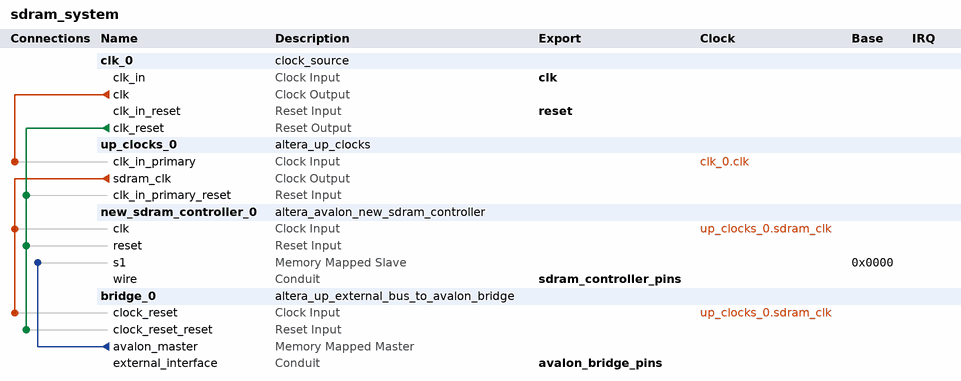
[diagram p0: system contents]
# Platform Designer (Qsys) system sdram_system, Cyclone II EP2C20F484C7
# Parameters at their usual value, and those the tool derives, are not listed.
package require -exact qsys 13.0
create_system sdram_system
set_project_property DEVICE_FAMILY {Cyclone II}
set_project_property DEVICE EP2C20F484C7

add_instance clk_0 clock_source 13.0
set_instance_parameter_value clk_0 clockFrequency 50000000

add_instance up_clocks_0 altera_up_clocks 13.0
set_instance_parameter_value up_clocks_0 board DE1
set_instance_parameter_value up_clocks_0 vga_clk false
set_instance_parameter_value up_clocks_0 audio_clk false
set_instance_parameter_value up_clocks_0 audio_clk_freq 12.288

add_instance new_sdram_controller_0 altera_avalon_new_sdram_controller 13.0.1.99.2
set_instance_parameter_value new_sdram_controller_0 TAC 5.5
set_instance_parameter_value new_sdram_controller_0 TRCD 20.0
set_instance_parameter_value new_sdram_controller_0 TRP 20.0
set_instance_parameter_value new_sdram_controller_0 casLatency 3
set_instance_parameter_value new_sdram_controller_0 columnWidth 8
set_instance_parameter_value new_sdram_controller_0 dataWidth 16
set_instance_parameter_value new_sdram_controller_0 generateSimulationModel true
set_instance_parameter_value new_sdram_controller_0 model single_Micron_MT48LC4M32B2_7_chip
set_instance_parameter_value new_sdram_controller_0 numberOfBanks 4
set_instance_parameter_value new_sdram_controller_0 numberOfChipSelects 1
set_instance_parameter_value new_sdram_controller_0 powerUpDelay 100.0
set_instance_parameter_value new_sdram_controller_0 refreshPeriod 15.625
set_instance_parameter_value new_sdram_controller_0 rowWidth 12

add_instance bridge_0 altera_up_external_bus_to_avalon_bridge 13.0
set_instance_parameter_value bridge_0 addr_size 8
set_instance_parameter_value bridge_0 addr_size_multiplier Mbytes
set_instance_parameter_value bridge_0 data_size 16

# connections
add_connection clk_0.clk up_clocks_0.clk_in_primary clock
add_connection up_clocks_0.sdram_clk bridge_0.clock_reset clock
add_connection up_clocks_0.sdram_clk new_sdram_controller_0.clk clock
add_connection clk_0.clk_reset bridge_0.clock_reset_reset reset
add_connection clk_0.clk_reset new_sdram_controller_0.reset reset
add_connection clk_0.clk_reset up_clocks_0.clk_in_primary_reset reset
add_connection bridge_0.avalon_master new_sdram_controller_0.s1 avalon
set_connection_parameter_value bridge_0.avalon_master/new_sdram_controller_0.s1 baseAddress 0x0000

# exported interfaces
add_interface clk clock sink
set_interface_property clk EXPORT_OF clk_0.clk_in
add_interface reset reset sink
set_interface_property reset EXPORT_OF clk_0.clk_in_reset
add_interface sdram_controller_pins conduit end
set_interface_property sdram_controller_pins EXPORT_OF new_sdram_controller_0.wire
add_interface avalon_bridge_pins conduit end
set_interface_property avalon_bridge_pins EXPORT_OF bridge_0.external_interface

set_interconnect_requirement {$system} qsys_mm.clockCrossingAdapter HANDSHAKE
set_interconnect_requirement {$system} qsys_mm.maxAdditionalLatency 1

save_system sdram_system.qsys
